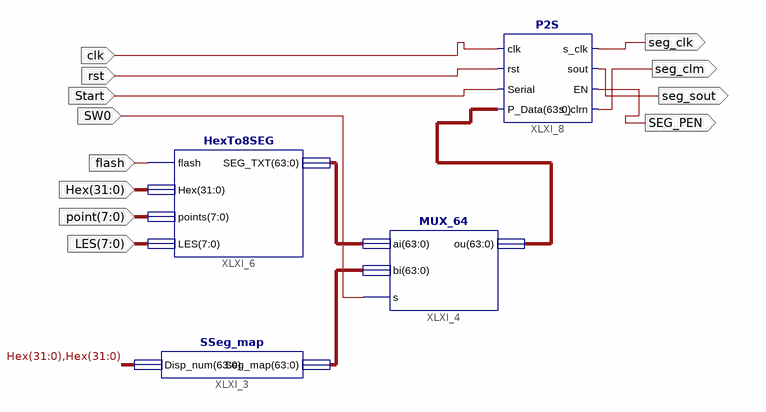
[diagram p0: schematic sheet 1]
// Xilinx ISE schematic Display.sch (kintex7) as structural Verilog: 4 symbols, 12 ports
module Display (
  input  rst,
  input  Start,
  input  clk,
  input  flash,
  input  [31:0] Hex,
  input  [7:0] point,
  input  [7:0] LES,
  input  SW0,
  output seg_clk,
  output seg_sout,
  output SEG_PEN,
  output seg_clm
);

  wire [63:0] Seg_map, SEG_TXT, XLXN_5;

  SSeg_map XLXI_3 (.Disp_num({Hex, Hex}), .Seg_map(Seg_map));
  MUX_64 XLXI_4 (.ai(SEG_TXT), .bi(Seg_map), .s(SW0), .ou(XLXN_5));
  HexTo8SEG XLXI_6 (.flash(flash), .Hex(Hex), .points(point), .LES(LES), .SEG_TXT(SEG_TXT));
  P2S XLXI_8 (
    .s_clrn(seg_clm), .sout(seg_sout), .rst(rst), .EN(SEG_PEN), .Serial(Start), .clk(clk), .s_clk(seg_clk),
    .P_Data(XLXN_5));
endmodule
